# EAGLE design pm2012 (EAGLE 5.11)
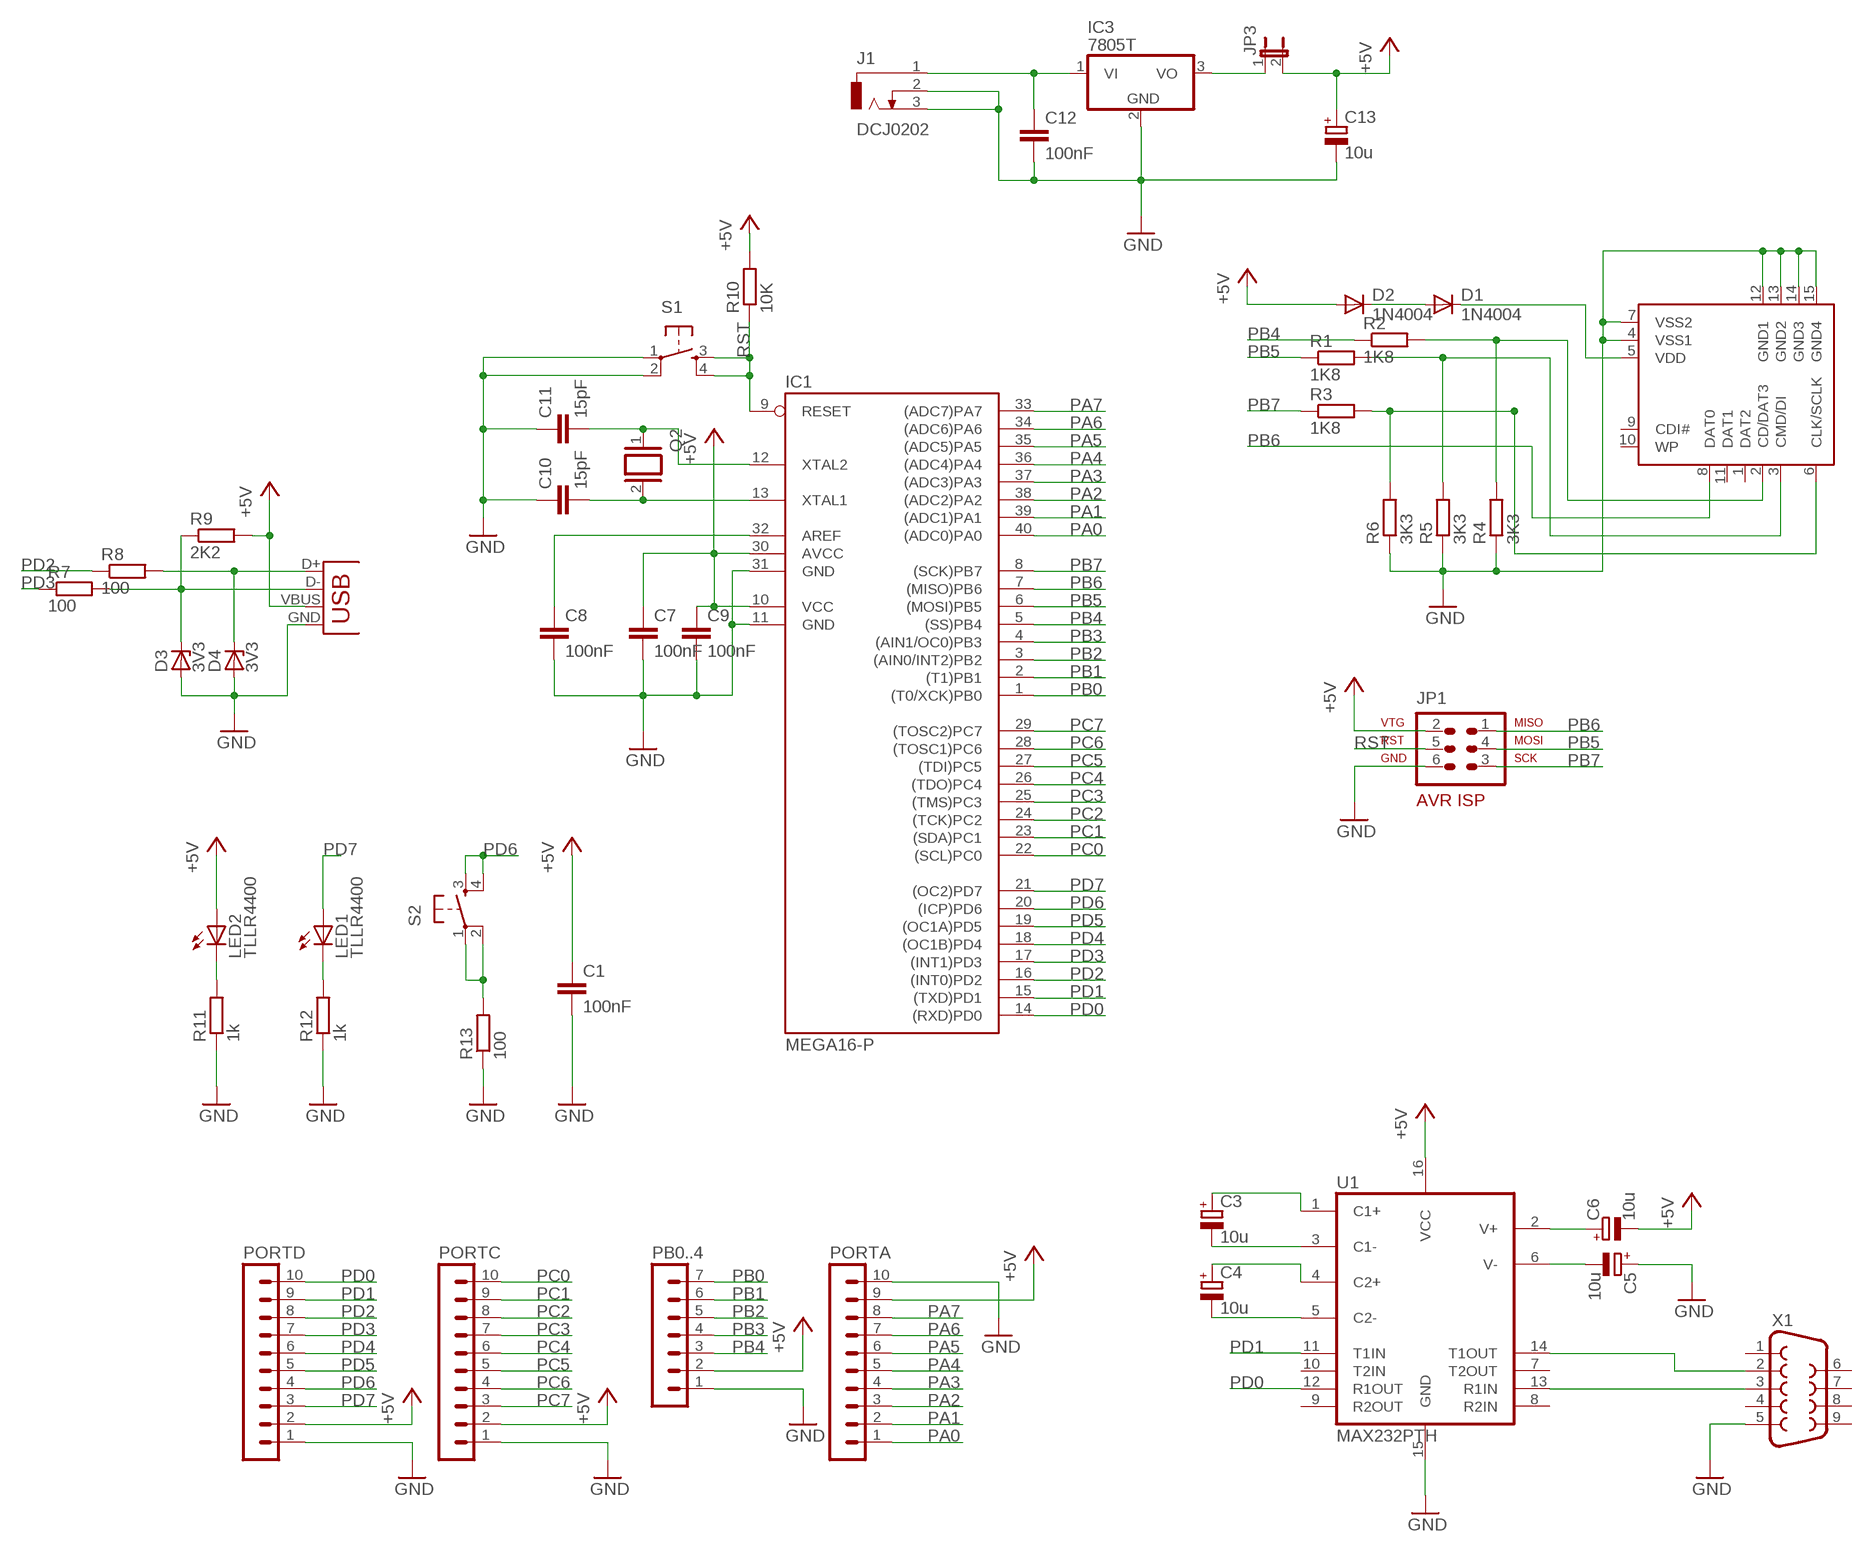
[diagram p0: schematic, sheet 1]

## Parts
C1  100nF  C-EU025-025X050  [C025-025X050]
C3  10u  CPOL-EUE2.5-5  [E2,5-5]
C4  10u  CPOL-EUE2.5-5  [E2,5-5]
C5  10u  CPOL-EUE2.5-5  [E2,5-5]
C6  10u  CPOL-EUE2.5-5  [E2,5-5]
C7  100nF  C-EU025-025X050  [C025-025X050]
C8  100nF  C-EU025-025X050  [C025-025X050]
C9  100nF  C-EU025-025X050  [C025-025X050]
C10  15pF  C-EU025-025X050  [C025-025X050]
C11  15pF  C-EU025-025X050  [C025-025X050]
C12  100nF  C-EU025-025X050  [C025-025X050]
C13  10u  CPOL-EUE2.5-5  [E2,5-5]
D1  1N4004  [DO41-10]
D2  1N4004  [DO41-10]
D3  3V3  ZENER-DIODEDO34-7  [DO34Z7]
D4  3V3  ZENER-DIODEDO34-7  [DO34Z7]
IC1  MEGA16-P  [DIL40]
IC3  7805T  [TO220H]
J1  DCJ0202  [DCJ0202]
JP1  AVR-ISP-6  [AVR-ISP-6]
JP3  JP1E  [JP1]
LED1  TLLR4400  [LED3MM]
LED2  TLLR4400  [LED3MM]
PB0..4  MA07-1  [MA07-1]
PORTA  MA10-1W  [MA10-1W]
PORTC  MA10-1W  [MA10-1W]
PORTD  MA10-1W  [MA10-1W]
Q2  XTAL/S  [QS]
R1  1K8  R-EU_M1206  [M1206]
R2  1K8  R-EU_M1206  [M1206]
R3  1K8  R-EU_M1206  [M1206]
R4  3K3  R-EU_M1206  [M1206]
R5  3K3  R-EU_M1206  [M1206]
R6  3K3  R-EU_M1206  [M1206]
R7  100  R-EU_0204/7  [0204/7]
R8  100  R-EU_0204/7  [0204/7]
R9  2K2  R-EU_0204/7  [0204/7]
R10  10K  R-EU_0204/7  [0204/7]
R11  1k  R-EU_0204/7  [0204/7]
R12  1k  R-EU_0204/7  [0204/7]
R13  100  R-EU_0204/7  [0204/7]
S1  TAC_SWITCHPTH  [TACTILE-PTH]
S2  TAC_SWITCHPTH  [TACTILE-PTH]
U1  MAX232PTH  [DIL16]
U$2  SD CARD  SDCARDVAR2  [SDCMF-10915W010]
X1  DB9  [DB9]
X2  USBPTH  [USB-B-PTH]

## Nets
+5V: C1.1 C6.- C7.1 C9.1 C13.+ D2.A IC1.10(VCC) IC1.30(AVCC) JP1.2 JP3.2 LED2.A PB0..4.2 PORTA.9 PORTC.2 PORTD.2 R9.2 R10.2 U1.16(VCC) X2.VBUS
GND: C1.2 C5.+ C7.2 C8.2 C9.2 C10.1 C11.1 C12.2 C13.- D3.A D4.A IC1.11(GND) IC1.31(GND) IC3.2(GND) J1.2 J1.3 JP1.6 PB0..4.1 PORTA.10 PORTC.1 PORTD.1 R4.1 R5.1 R6.1 R11.1 R12.1 R13.1 S1.1 S1.2 U1.15(GND) U$2.4(VSS1) U$2.7(VSS2) U$2.12(GND1) U$2.13(GND2) U$2.14(GND3) U$2.15(GND4) X1.5 X2.GND
N$1: C3.- U1.3(C1-)
N$2: C3.+ U1.1(C1+)
N$3: C4.- U1.5(C2-)
N$4: C4.+ U1.4(C2+)
N$5: C6.+ U1.2(V+)
N$6: C5.- U1.6(V-)
N$7: U1.14(T1OUT) X1.2
N$8: U1.13(R1IN) X1.3
N$9: D1.C U$2.5(VDD)
N$10: D1.A D2.C
N$11: R1.2 R5.2 U$2.3(CMD/DI)
N$12: R2.2 R4.2 U$2.2(CD/DAT3)
N$13: R3.2 R6.2 U$2.6(CLK/SCLK)
N$14: D4.C R8.2 X2.D+
N$15: D3.C R7.2 R9.1 X2.D-
N$16: C12.1 IC3.1(VI) J1.1
N$17: R13.2 S2.1 S2.2
N$18: IC3.3(VO) JP3.1
N$20: C8.1 IC1.32(AREF)
N$21: C10.2 IC1.13(XTAL1) Q2.2
N$22: C11.2 IC1.12(XTAL2) Q2.1
N$24: LED1.K(C) R12.2
N$25: LED2.K(C) R11.2
PA0: IC1.40((ADC0)PA0) PORTA.1
PA1: IC1.39((ADC1)PA1) PORTA.2
PA2: IC1.38((ADC2)PA2) PORTA.3
PA3: IC1.37((ADC3)PA3) PORTA.4
PA4: IC1.36((ADC4)PA4) PORTA.5
PA5: IC1.35((ADC5)PA5) PORTA.6
PA6: IC1.34((ADC6)PA6) PORTA.7
PA7: IC1.33((ADC7)PA7) PORTA.8
PB0: IC1.1((T0/XCK)PB0) PB0..4.7
PB1: IC1.2((T1)PB1) PB0..4.6
PB2: IC1.3((AIN0/INT2)PB2) PB0..4.5
PB3: IC1.4((AIN1/OC0)PB3) PB0..4.4
PB4: IC1.5((SS)PB4) PB0..4.3 R2.1
PB5: IC1.6((MOSI)PB5) JP1.4 R1.1
PB6: IC1.7((MISO)PB6) JP1.1 U$2.8(DAT0)
PB7: IC1.8((SCK)PB7) JP1.3 R3.1
PC0: IC1.22((SCL)PC0) PORTC.10
PC1: IC1.23((SDA)PC1) PORTC.9
PC2: IC1.24((TCK)PC2) PORTC.8
PC3: IC1.25((TMS)PC3) PORTC.7
PC4: IC1.26((TDO)PC4) PORTC.6
PC5: IC1.27((TDI)PC5) PORTC.5
PC6: IC1.28((TOSC1)PC6) PORTC.4
PC7: IC1.29((TOSC2)PC7) PORTC.3
PD0: IC1.14((RXD)PD0) PORTD.10 U1.12(R1OUT)
PD1: IC1.15((TXD)PD1) PORTD.9 U1.11(T1IN)
PD2: IC1.16((INT0)PD2) PORTD.8 R8.1
PD3: IC1.17((INT1)PD3) PORTD.7 R7.1
PD4: IC1.18((OC1B)PD4) PORTD.6
PD5: IC1.19((OC1A)PD5) PORTD.5
PD6: IC1.20((ICP)PD6) PORTD.4 S2.3 S2.4
PD7: IC1.21((OC2)PD7) LED1.A PORTD.3
RST: IC1.9(RESET) JP1.5 R10.1 S1.3 S1.4
Unconnected: U1.7(T2OUT) U1.8(R2IN) U1.9(R2OUT) U1.10(T2IN) U$2.1(DAT2) U$2.9(CDI#) U$2.10(WP) U$2.11(DAT1) X1.1 X1.4 X1.6 X1.7 X1.8 X1.9

## Library data of the parts
C1 C7-C12 = resistor:C-EU: CAPACITOR, European symbol
C3-C6 C13 = resistor:CPOL-EU: POLARIZED CAPACITOR, European symbol
D1 D2 = diode:1N4004: DIODE general purpose rectifier, 1 A
D3 D4 = diode:ZENER-DIODE: Z-Diode
IC1 = atmel:MEGA16-P: MICROCONTROLLER 16 Kbytes FLASH 1 kbytes SRAM 512 bytes EEPROM USART 8-channel 10 bit ADC Source: avr.lbr; MPN: ATMEGA16-16PU; OC_FARNELL: 9171142; OC_NEWARK: 01M6885
IC3 = linear:78*: Positive VOLTAGE REGULATOR Source: http://cache.national.com/ds/LM/LM78L05.pdf http://www.fairchildsemi.com/ds/LM/LM7805.pdf
J1 = con-jack:DCJ0202: DC POWER JACK Source: DCJ0202.pdf; OC_FARNELL: unknown; OC_NEWARK: unknown
JP1 = atmel-1:AVR-ISP-6: AVR ISP-6 Serial Programming Header
JP3 = jumper:JP1E: JUMPER
LED1 LED2 = led:TLLR4400: Low Current (2mA) LED 3 mm Tinted Diffused Package color RED Source: Data sheet <http://www.farnell.com/datasheets/391100.pdf>; MF: VISHAY SEMICONDUCTOR; OC_FARNELL: 1612437
PB0..4 = con-lstb:MA07-1: PIN HEADER; OC_FARNELL: unknown; OC_NEWARK: unknown
PORTA PORTC PORTD = con-lstb:MA10-1W: PIN HEADER; OC_FARNELL: unknown; OC_NEWARK: unknown
Q2 = special:XTAL/S: CRYSTAL
R1-R13 = resistor:R-EU_: RESISTOR, European symbol
S1 S2 = SparkFun:TAC_SWITCH: Momentary Switch Button commonly used for reset or general input. Spark Fun Electronics SKU : COM-00097
U1 = SparkFun:MAX232: RS232 Transceiver Very common IC. This is generically called 'MAX232', but works with the 3V equivalent MAX3232 generic ICs. Field tested and mother approved. Spark Fun Electronics SKU : COM-00316 (DIP) and COM-00589 (SMD)
U$2 = kingfont_sdcmf10915w010_covek:SDCARD: SD card connector KINGFONT SDCMF-10915W010
X1 = SparkFun:DB9: DB9 Connector Standard DB9 (D-Sub 9) serial connector. Can be used for CAN bus as well as RS485 and RS232. Footprint production proven. Spark Fun Electronics SKU : PRT-00429
X2 = SparkFun:USB: USB Connectors USB-B-PTH is fully proven SKU : PRT-00139 USB-miniB is fully proven SKU : PRT-00587 USB-A-PCB is untested. USB-A-H is throughly reviewed, but untested. Spark Fun Electronics SKU : PRT-00437 USB-B-SMT is throughly reviewed, but untested. Needs silkscreen touching up. USB-A-S has not been used/tested USB-MB-H has not been used/tested

## Board
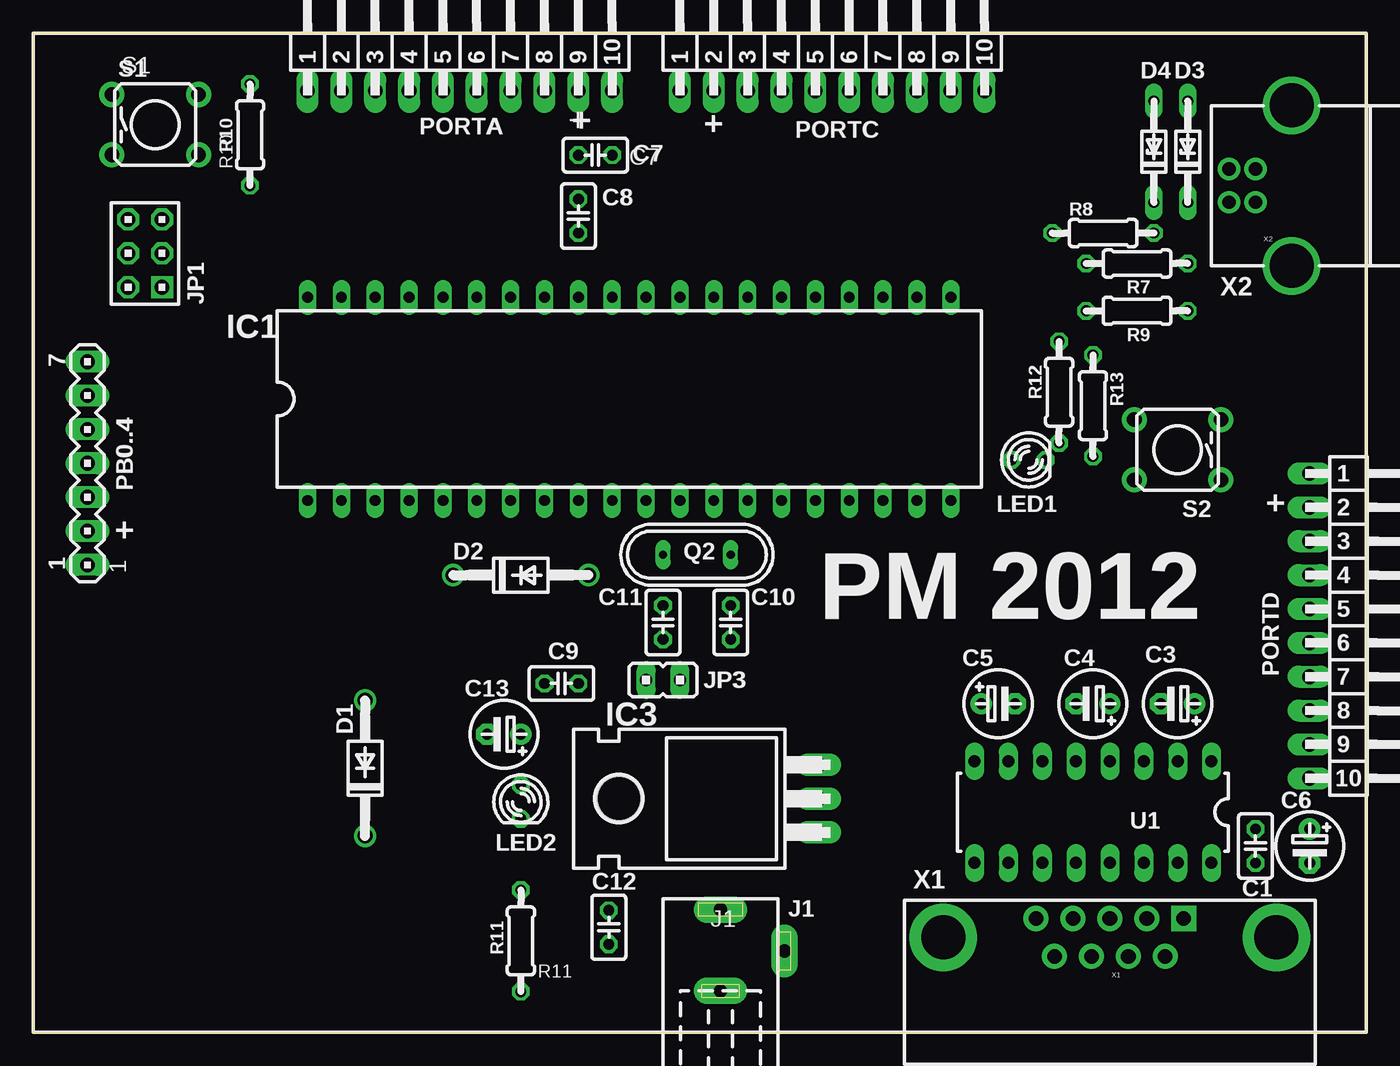
[diagram p1: board, top side]
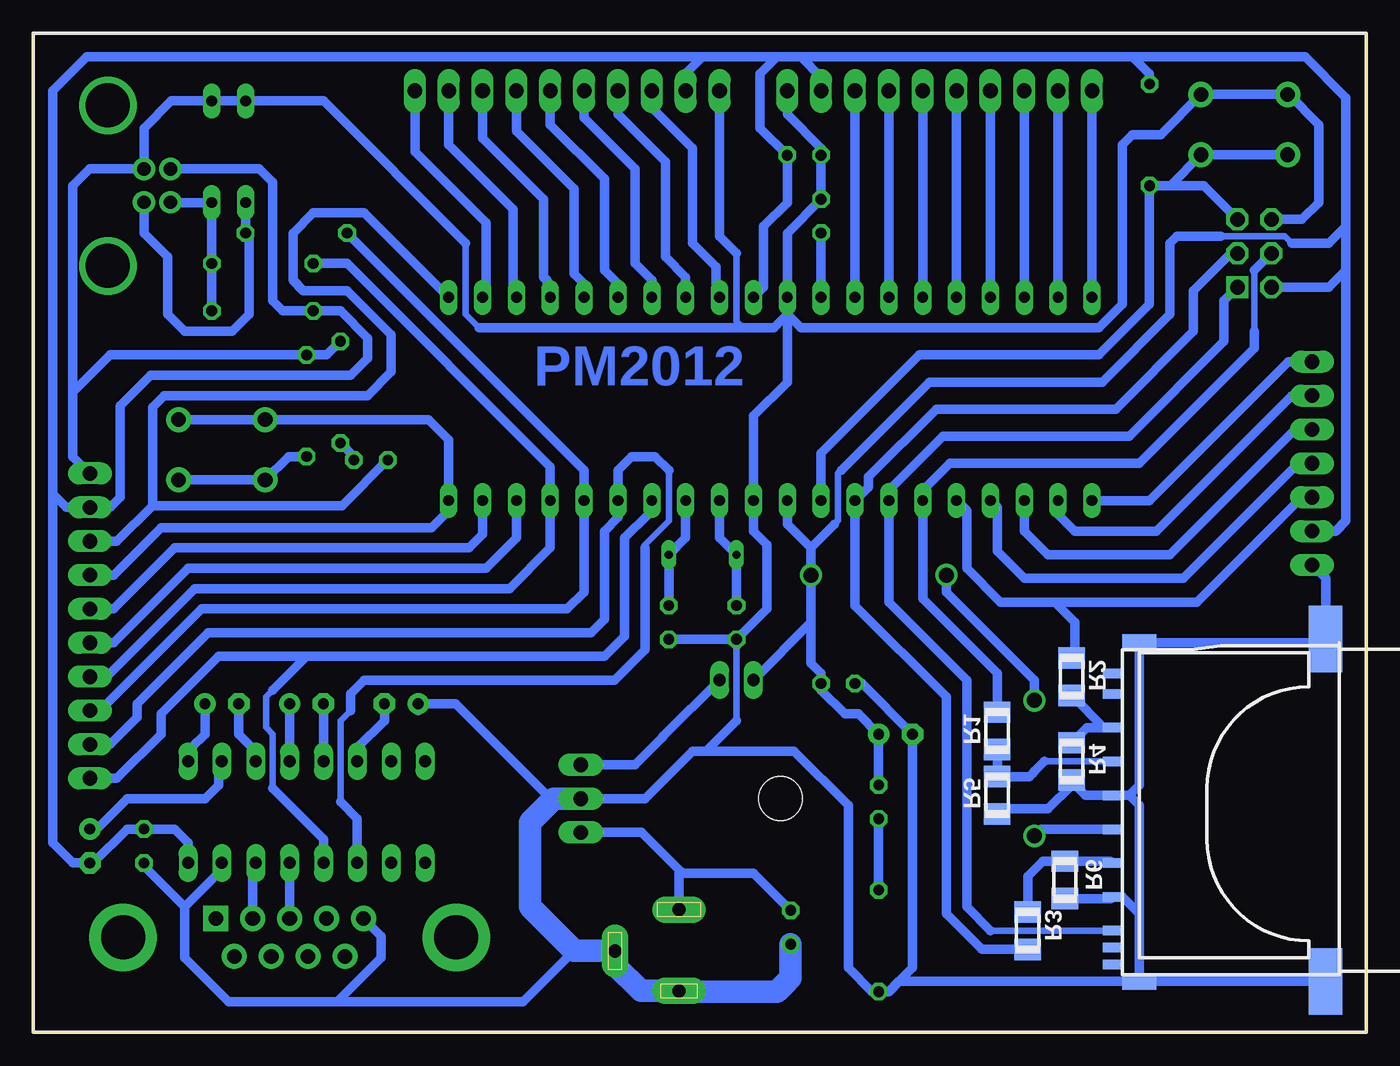
[diagram p2: board, bottom side, seen from below]

Size 100 x 74.92 mm. Coordinates in mm from the lower left corner, seen from the top.
Outline: 0,0 100,0 100,74.92 0,74.92 0,0
Copper layers (1*16): Top 0.035mm / dielectric 1.5mm / Bottom 0.035mm
Design rules "10mils *": minimum track width 10mil, minimum drill 24mil, track to track 26mil, track to pad 10mil, pad to pad 10mil, via to via 10mil, smd to smd 10mil, copper to edge 40mil, drill to drill 10mil, minimum pad ring 10mil, minimum via ring 8mil, stop-mask expansion 0mil, vias tented up to drill 0mil, thermal gap 10mil

### Footprints (pad centres in the part's own frame; a part is rotated, then mirrored left to right if it is on the bottom)
C025-025X050 = drill 0.813 octagon: 1 -1.27,0; 2 1.27,0
E2,5-5 = drill 0.813 pad 1.6 round: + -1.27,0 | drill 0.813 pad 1.6 octagon: - 1.27,0
DO41-10 = drill 1.118 round: A 5.08,0; C -5.08,0
DO34Z7 = drill 0.813 long: A 3.81,0; C -3.81,0
DIL40 = drill 0.813 long: 1 -24.13,-7.62; 2 -21.59,-7.62; 3 -19.05,-7.62; 4 -16.51,-7.62; 5 -13.97,-7.62; 6 -11.43,-7.62; 7 -8.89,-7.62; 8 -6.35,-7.62; 9 -3.81,-7.62; 10 -1.27,-7.62; 11 1.27,-7.62; 12 3.81,-7.62; 13 6.35,-7.62; 14 8.89,-7.62; 15 11.43,-7.62; 16 13.97,-7.62; 17 16.51,-7.62; 18 19.05,-7.62; 19 21.59,-7.62; 20 24.13,-7.62; 21 24.13,7.62; 22 21.59,7.62; 23 19.05,7.62; 24 16.51,7.62; 25 13.97,7.62; 26 11.43,7.62; 27 8.89,7.62; 28 6.35,7.62; 29 3.81,7.62; 30 1.27,7.62; 31 -1.27,7.62; 32 -3.81,7.62; 33 -6.35,7.62; 34 -8.89,7.62; 35 -11.43,7.62; 36 -13.97,7.62; 37 -16.51,7.62; 38 -19.05,7.62; 39 -21.59,7.62; 40 -24.13,7.62
TO220H = drill 1.118 long: 1 -2.54,-10.16; 2 0,-10.16; 3 2.54,-10.16 | hole 3.302: 0,4.826
DCJ0202 = drill 1 pad 2 long: 1 0,3.1; 2 4.8,0; 3 0,-3
AVR-ISP-6 = drill 1.1 square: 1 -2.54,-1.27 | drill 1.1 octagon: 2 -2.54,1.27; 3 0,-1.27; 4 0,1.27; 5 2.54,-1.27; 6 2.54,1.27
JP1 = drill 0.914 long: 1 0,-1.27; 2 0,1.27
LED3MM = drill 0.813 octagon: A -1.27,0; K 1.27,0
MA07-1 = drill 1.1 long: 1 -7.62,0; 2 -5.08,0; 3 -2.54,0; 4 0,0; 5 2.54,0; 6 5.08,0; 7 7.62,0
MA10-1W = drill 1.1 long: 1 -11.43,0; 2 -8.89,0; 3 -6.35,0; 4 -3.81,0; 5 -1.27,0; 6 1.27,0; 7 3.81,0; 8 6.35,0; 9 8.89,0; 10 11.43,0
QS = drill 0.61 long: 1 -2.54,0; 2 2.54,0
M1206 = smd 1.6 x 2: 1 -1.4,0; 2 1.4,0
0204/7 = drill 0.813 octagon: 1 -3.81,0; 2 3.81,0
TACTILE-PTH = drill 1.1 pad 1.88 round: 1 -3.251,2.261; 2 3.251,2.261; 3 -3.251,-2.261; 4 3.251,-2.261
DIL16 = drill 0.9 long: 1 -8.89,-3.81; 2 -6.35,-3.81; 3 -3.81,-3.81; 4 -1.27,-3.81; 5 1.27,-3.81; 6 3.81,-3.81; 7 6.35,-3.81; 8 8.89,-3.81; 9 8.89,3.81; 10 6.35,3.81; 11 3.81,3.81; 12 1.27,3.81; 13 -1.27,3.81; 14 -3.81,3.81; 15 -6.35,3.81; 16 -8.89,3.81
SDCMF-10915W010 = smd 0.711 x 1.422: 1 8.366,13.462; 2 5.826,13.462; 3 3.286,13.462; 4 0.746,13.462; 5 -1.794,13.462; 6 -4.334,13.462; 7 -6.874,13.462; 8 -9.398,13.462; 9 9.906,13.462; 10 -11.938,13.462; 11 -10.668,13.462 | smd 1.27 x 2.54: 12 12.192,11.43; 15 -13.208,11.43 | smd 5 x 2.54: 13 12.47,-2.54; 14 -13.208,-2.54
DB9 = drill 1.1 pad 1.88 square: 1 -5.54,-1.42 | drill 1.1 pad 1.88 round: 2 -2.77,-1.42; 3 0,-1.42; 4 2.77,-1.42; 5 5.54,-1.42; 6 -4.15,1.42; 7 -1.38,1.42; 8 1.38,1.42; 9 4.15,1.42 | drill 3.3 pad 5.08 round: G1 -12.5,0; G2 12.5,0
USB-B-PTH = drill 1 pad 1.676 round: D+ 0,1.25; D- 1.981,1.25; GND 0,-1.25; VBUS 1.981,-1.25 | drill 3.3 round: P$1 -2.718,-6.02; P$2 -2.718,6.02

### Placement (x,y rotation side)
C1  91.69,13.97 270 top
C3  85.85,24.64 180 top
C4  79.5,24.64 180 top
C5  72.39,24.64 0 top
C6  95.76,13.97 270 top
C7  42.16,65.79 180 top
C8  40.89,61.21 90 top
C9  39.62,26.16 180 top
C10  52.32,30.73 90 top
C11  47.24,30.73 90 top
C12  43.18,7.87 270 top
C13  35.31,22.35 180 top
D1  24.89,19.81 90 top
D2  36.58,34.29 0 top
D3  86.61,66.04 90 top
D4  84.07,66.04 90 top
IC1  44.7,47.5 0 top
IC3  48.77,17.53 90 top
J1  51.56,6.1 0 top
JP1  8.38,58.42 90 top
JP3  47.24,26.42 90 top
LED1  74.68,42.93 0 top
LED2  36.58,17.27 270 top
PB0..4  4.06,42.67 90 top
PORTA  32,70.61 0 top
PORTC  59.94,70.61 0 top
PORTD  95.76,30.48 270 top
Q2  49.78,35.81 0 top
R1  27.69,22.61 270 bottom
R2  22.1,26.67 270 bottom
R3  25.4,7.62 90 bottom
R4  22.1,20.32 90 bottom
R5  27.69,17.78 90 bottom
R6  22.61,11.43 90 bottom
R7  82.8,57.66 0 top
R8  80.26,59.94 0 top
R9  82.8,54.1 180 top
R10  16.26,67.31 90 top
R11  36.58,6.86 90 top
R12  76.96,48.01 270 top
R13  79.5,46.99 270 top
S1  9.14,68.07 0 top
S2  85.85,43.69 180 top
U1  79.5,16.51 180 top
U$2  5.59,17.02 90 bottom
X1  80.77,7.11 180 top
X2  91.69,63.5 180 top

### Tracks (layer width: path | path; a pad name or v marks a point on that pad's centre or on a via)
+5V
  Bottom 0.5: 10.92,59.69 6.1,59.69 5.59,59.18 | 39.37,42.16 39.62,41.91 39.62,38.35 39.88,38.1
  Bottom 0.7: 41.66,36.32 D2.A 41.66,30.73 | 41.66,36.32 43.43,38.1 IC1.10 | LED2.A C13.+ 38.1,23.88 39.12,23.88 40.89,25.65 C9.1 40.89,26.92 41.66,27.69 41.66,30.73 | PORTA.9 40.89,71.63 42.42,73.15 | 17.53,73.15 42.42,73.15 | 5.59,55.88 JP1.2 2.79,55.88 1.52,57.15 | R10.2 16.26,71.88 17.53,73.15 | U1.16 88.39,14.22 89.41,15.24 C1.1 92.96,15.24 95.5,12.7 C6.- 97.03,12.7 98.55,14.22 98.55,40.39 | 98.55,40.39 97.54,39.37 PORTD.2 94.23,39.37 93.47,40.13 93.47,46.99 91.19,49.28 76.2,49.28 74.93,50.55 74.93,52.07 76.96,54.1 R9.2 81.28,54.1 82.04,54.86 82.04,63.75 83.06,64.77 89.69,64.77 X2.VBUS | 98.55,40.39 98.55,70.61 96.01,73.15 49.78,73.15 | PB0..4.2 2.29,37.59 1.52,38.35 1.52,57.15 | 10.92,59.69 14.22,59.69 14.73,59.18 14.73,53.85 19.81,48.77 32.77,48.77 39.37,42.16 | IC1.30 45.21,55.88 45.21,60.45 43.43,62.23 C7.1 45.47,67.82 45.47,71.88 44.2,73.15 | 42.42,73.15 44.2,73.15 | PORTC.2 51.05,71.88 49.78,73.15 | 44.2,73.15 49.78,73.15 | 41.66,30.73 JP3.2 | 17.53,73.15 4.57,73.15 1.52,70.1 1.52,60.45 | 1.52,57.15 1.52,60.45 | 5.59,59.18 2.79,59.18 1.52,60.45 | 39.88,38.1 41.66,36.32
GND
  Bottom 0.5: 66.55,52.83 67.56,53.85 67.56,59.18 | 47.24,58.42 47.24,53.34 46.74,52.83 | 47.24,23.37 C11.1
  Bottom 0.7: 43.43,53.85 43.43,48.77 45.97,46.23 IC1.11 45.97,37.59 44.96,36.58 44.96,31.75 C11.1 C10.1 | 43.43,53.85 IC1.31 43.43,59.94 C8.2 C7.2 40.89,66.29 43.43,68.83 PORTA.10 | J1.3 51.51,3.05 | 56.39,5.08 56.39,6.07 J1.2 | 43.43,53.85 44.45,52.83 46.74,52.83 66.55,52.83 | 67.56,59.18 78.23,69.85 D4.A D3.A 89.66,69.85 91.69,67.82 X2.GND 91.71,64.77 95.76,64.77 97.03,63.5 97.03,48.01 | 43.43,53.85 42.42,52.83 20.07,52.83 18.29,54.61 18.29,66.55 17.53,67.31 15.42,67.31 S1.2 S1.1 5.82,70.33 3.56,68.07 3.56,62.23 4.83,60.96 JP1.6 | 71.12,24.13 C5.+ 68.33,24.64 61.09,17.4 60.96,17.53 | 75.23,8.08 X1.5 73.91,7.21 73.91,5.59 77.22,2.29 | 88.65,9.4 88.65,5.59 85.34,2.29 77.22,2.29 | U$2.13 3.33,29.21 U$2.12 17.02,18.54 17.78,17.78 | 17.78,17.78 19.03,17.78 U$2.4 19.07,17.78 21.08,17.78 22.1,18.8 R4.1 22.1,18.54 23.88,16.76 27.3,16.76 R5.1 | 17.02,8.89 17.02,17.02 17.78,17.78 | U$2.15 17.02,8.89 | 17.02,8.89 18.29,10.16 19.03,10.16 U$2.7 19.16,10.03 R6.1 | C9.2 37.85,26.16 C13.- 34.04,4.83 35.05,3.81 | R6.1 22.35,10.03 | 97.03,48.01 97.03,43.18 PORTD.1 | U$2.13 2.77,29.49 | U$2.13 3.05,34.04 PB0..4.1 | R6.1 23.24,10.03 | 88.65,9.4 85.85,12.19 U1.15 | 88.65,9.4 91.69,12.45 C1.2 | 97.03,48.01 94.23,50.8 R13.1 77.98,50.8 R12.1 | 47.24,58.42 48.51,59.69 PORTC.1 | 43.18,4.06 43.43,3.81 43.18,3.56 | 59.44,6.1 63.25,2.29 77.22,2.29 | IC3.2 54.1,17.53 50.55,21.08 49.53,21.08 | 49.53,21.08 47.24,23.37 | U$2.15 35.05,3.81 | 35.05,3.81 35.81,3.05 R11.1 37.08,3.05 38.86,4.83 38.86,17.02 42.93,21.08 49.53,21.08 | U$2.14 U$2.15
  Bottom 1.676: J1.3 54.4,3.1 56.39,5.08 | 51.51,3.05 44.2,3.05 43.43,3.81 | 43.18,4.06 C12.2 | IC3.2 60.96,17.53 | J1.2 59.44,6.1 62.74,9.4 62.74,15.75 61.09,17.4
N$1
  Bottom 0.7: U1.3 83.57,20.57 83.57,21.34 84.58,22.35 C3.-
N$2
  Bottom 0.7: U1.1 88.14,20.57 88.14,21.34 87.12,22.35 C3.+
N$3
  Bottom 0.7: U1.5 C4.-
N$4
  Bottom 0.7: U1.4 C4.+
N$5
  Bottom 0.7: U1.2 86.11,20.07 86.11,18.54 87.12,17.53 92.96,17.53 95.25,15.24 C6.+
N$6
  Bottom 0.7: U1.6 75.69,21.34 73.66,23.37 C5.-
N$7
  Bottom 0.7: X1.2 83.54,12.47 U1.14
N$8
  Bottom 0.7: X1.3 U1.13
N$9
  Bottom 0.7: D1.C 24.4,15.22 U$2.5
N$10
  Bottom 0.7: D2.C 31.5,33.02 24.89,26.42 D1.A
N$11
  Bottom 0.5: 19.05,20.32 24.13,20.32
  Bottom 0.7: U$2.3 19.05,20.32 | R1.2 R5.2 25.27,19.18 25.02,19.43 24.89,19.56 24.13,20.32
N$12
  Bottom 0.7: 19.07,22.86 U$2.2 19.67,22.84 | 19.67,22.84 R2.2 | R4.2 20.97,22.84 19.67,22.84
N$13
  Bottom 0.7: U$2.6 19.07,12.7 19.2,12.83 22.35,12.83 R6.2 24.25,12.83 25.4,11.68 R3.2
N$14
  Bottom 0.7: D4.C R8.2 83.82,59.69 83.82,53.85 85.09,52.58 88.65,52.58 89.92,53.85 89.92,58.17 91.69,59.94 X2.D+
N$15
  Bottom 0.7: X2.D- 89.69,62.23 D3.C R7.2 R9.1
N$16
  Bottom 0.7: 51.56,11.94 J1.1 | 51.56,11.94 51.44,12.06 54.36,14.99 IC3.1 | C12.1 45.97,11.94 51.56,11.94
N$17
  Bottom 0.7: S2.1 S2.2 80.85,43.18 R13.2
N$18
  Bottom 0.7: JP3.1 52.7,22.23 52.83,22.1 54.86,20.07 IC3.3
N$20
  Bottom 0.7: IC1.32 C8.1
N$21
  Bottom 0.7: IC1.13 51.05,37.08 Q2.2 C10.2
N$22
  Bottom 0.7: IC1.12 48.51,37.08 Q2.1 C11.2
N$24
  Bottom 0.7: R12.2 75.95,43.18 LED1.K
N$25
  Bottom 0.7: R11.2 LED2.K
PA0
  Bottom 0.7: IC1.40 PORTA.1
PA1
  Bottom 0.7: IC1.39 PORTA.2
PA2
  Bottom 0.7: IC1.38 PORTA.3
PA3
  Bottom 0.7: IC1.37 PORTA.4
PA4
  Bottom 0.7: IC1.36 PORTA.5
PA5
  Bottom 0.7: IC1.35 PORTA.6
PA6
  Bottom 0.7: IC1.34 PORTA.7
PA7
  Bottom 0.7: IC1.33 PORTA.8
PB0
  Bottom 0.7: PB0..4.7 5.84,50.29 16.26,39.88 IC1.1
PB1
  Bottom 0.7: PB0..4.6 5.59,47.75 15.75,37.59 21.84,37.59 23.11,38.86 IC1.2
PB2
  Bottom 0.7: IC1.3 25.65,37.59 23.88,35.81 14.73,35.81 5.33,45.21 PB0..4.5
PB3
  Bottom 0.7: IC1.4 27.69,39.37 27.69,36.07 25.65,34.04 13.72,34.04 5.08,42.67 PB0..4.4
PB4
  Bottom 0.7: IC1.5 29.97,39.12 29.97,34.8 27.43,32.26 23.37,32.26 | R2.1 21.84,28.32 21.84,30.73 23.37,32.26 | PB0..4.3 4.83,40.13 12.7,32.26 23.37,32.26
PB5
  Bottom 0.5: 8.38,52.58 8.38,57.15
  Bottom 0.7: 8.38,57.15 JP1.4 | R1.1 27.69,26.92 33.27,32.51 IC1.6 33.27,40.64 31.24,42.67 17.02,42.67 8.38,51.31 8.38,52.58
PB6
  Bottom 0.5: U$2.8 28.19,7.62
  Bottom 0.7: 28.19,7.62 29.97,9.4 29.97,26.42 35.81,32.26 35.81,34.29 35.81,34.8 IC1.7 35.81,40.64 31.75,44.7 17.78,44.7 10.67,51.82 10.67,54.86 JP1.1
PB7
  Bottom 0.7: R3.1 28.83,6.22 31.5,8.89 31.5,25.15 38.35,32 IC1.8 37.34,40.89 37.34,41.66 32.26,46.74 18.8,46.74 12.95,52.58 12.95,55.63 10.16,58.42 JP1.3
PC0
  Bottom 0.7: IC1.22 66.04,55.37 66.04,60.71 71.37,66.04 PORTC.10
PC1
  Bottom 0.7: IC1.23 64.01,55.37 64.01,61.72 68.83,66.55 PORTC.9
PC2
  Bottom 0.7: IC1.24 61.47,55.37 61.47,56.39 61.72,56.64 61.72,62.48 66.29,67.06 PORTC.8
PC3
  Bottom 0.7: IC1.25 58.67,56.13 59.44,56.9 59.44,63.25 63.75,67.56 PORTC.7
PC4
  Bottom 0.7: IC1.26 56.13,56.13 57.15,57.15 57.15,64.01 61.21,68.07 PORTC.6
PC5
  Bottom 0.7: IC1.27 53.59,56.39 54.86,57.66 54.86,64.77 58.67,68.58 PORTC.5
PC6
  Bottom 0.7: IC1.28 51.05,56.64 52.58,58.17 52.58,65.28 56.13,68.83 PORTC.4
PC7
  Bottom 0.7: IC1.29 48.77,55.37 48.77,57.4 50.55,59.18 50.55,66.29 53.59,69.34 PORTC.3
PD0
  Bottom 0.5: 82.04,18.29 82.04,22.35 82.55,22.86 82.55,25.15 82.04,25.65
  Bottom 0.7: 79.5,28.19 86.11,28.19 90.42,23.88 90.42,22.35 93.73,19.05 PORTD.10 | 79.5,28.19 82.04,25.65 | 79.5,28.19 57.15,28.19 55.63,29.72 55.63,37.08 53.85,38.86 53.85,39.62 IC1.14 | 82.04,18.29 78.23,14.48 U1.12
PD1
  Bottom 0.5: 76.96,17.27 76.96,23.37 76.2,24.13 | 52.32,42.16 52.32,38.35 54.1,36.58 54.1,36.32
  Bottom 0.7: 76.2,24.13 76.2,25.4 75.18,26.42 56.39,26.42 54.1,28.7 54.1,36.32 | 52.32,42.16 53.34,43.18 55.12,43.18 56.13,42.16 IC1.15 56.13,38.61 57.15,37.59 57.15,30.99 58.17,29.97 86.87,29.97 92.2,24.64 92.2,23.62 94.23,21.59 PORTD.9 | U1.11 75.69,16 76.96,17.27
PD2
  Bottom 0.7: R8.1 58.67,42.16 IC1.16 58.67,33.02 59.94,31.75 87.38,31.75 94.74,24.38 95,24.13 PORTD.8
PD3
  Bottom 0.7: IC1.17 61.21,39.62 | IC1.17 61.21,42.42 76.45,57.66 R7.1 | PORTD.7 94.74,26.67 94.49,26.67 87.88,33.27 64.26,33.27 61.21,36.32 IC1.17
PD4
  Bottom 0.7: IC1.18 63.75,37.08 66.04,34.8 88.39,34.8 93.98,29.21 PORTD.6
PD5
  Bottom 0.7: IC1.19 66.29,37.34 67.31,36.32 89.41,36.32 93.98,31.75 PORTD.5
PD6
  Bottom 0.7: S2.3 S2.4 70.33,45.95 68.83,44.45 IC1.20 68.83,39.12 70.1,37.85 90.42,37.85 93.98,34.29 PORTD.4
PD7
  Bottom 0.7: IC1.21 75.18,61.47 78.99,61.47 80.52,59.94 80.52,56.39 79.76,55.63 76.45,55.63 73.15,52.32 73.15,49.53 74.93,47.75 90.17,47.75 91.06,46.86 91.06,39.5 | PORTD.3 93.73,36.83 91.06,39.5 | LED1.A 76.83,39.5 91.06,39.5
RST
  Bottom 0.7: S1.3 S1.4 14.71,63.5 | 14.71,63.5 R10.1 16.26,54.61 20.07,50.8 33.53,50.8 40.89,43.43 IC1.9 | JP1.5 12.19,63.5 14.71,63.5

### Text on the board
Bottom: PM2012
tNames: + | + | + | +
_tsilk: 1 | 2 | 3 | 4 | 5 | 6 | 7 | 8 | 9 | 10 | 1 | 2 | 3 | 4 | 5 | 6 | 7 | 8 | 9 | 10 | S1 | D4 | D3 | + | PORTA | + | PORTC | R10 | C7 | C8 | R8 | X2 | JP1 | R7 | R9 | IC1 | 7 | R13 | R12 | PB0..4 | 1 | S2 | LED1 | + | 2 | + | D2 | 3 | 1 | Q2 | 4 | C11 | PORTD | C10 | PM 2012 | 5 | C5 | C4 | C3 | 6 | C9 | C13 | JP3 | 7 | IC3 | 8 | D1 | 9 | 10 | U1 | C6 | LED2 | C12 | X1 | C1 | J1 | R11
_bsilk: R2 | R1 | SDCard | R4 | R5 | R6 | R3